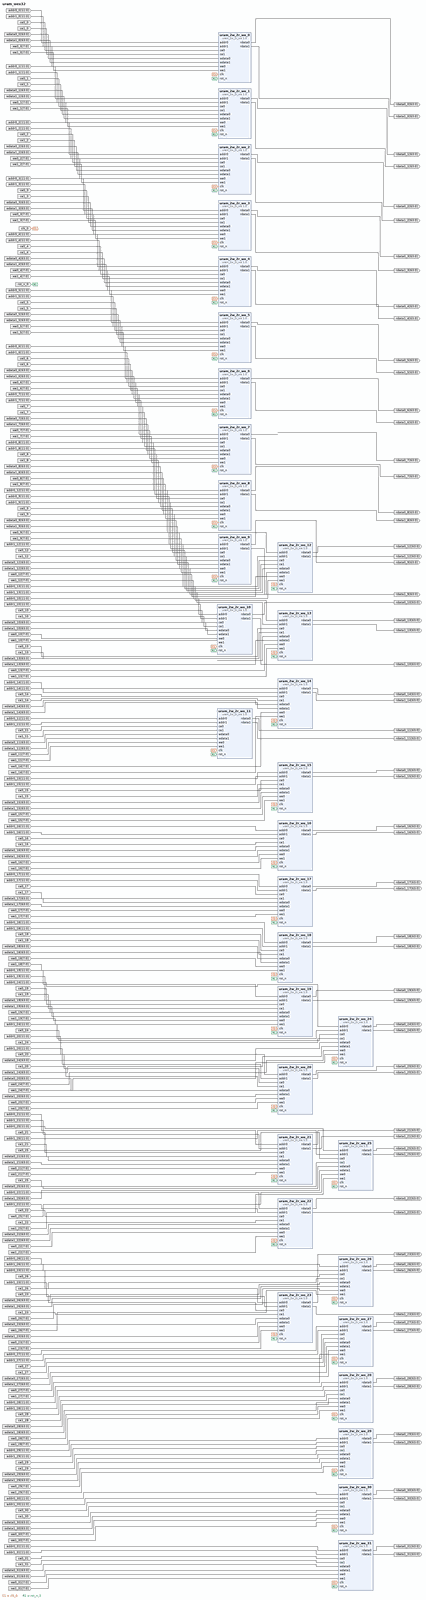
[diagram p0: block diagram of the top level, whole]
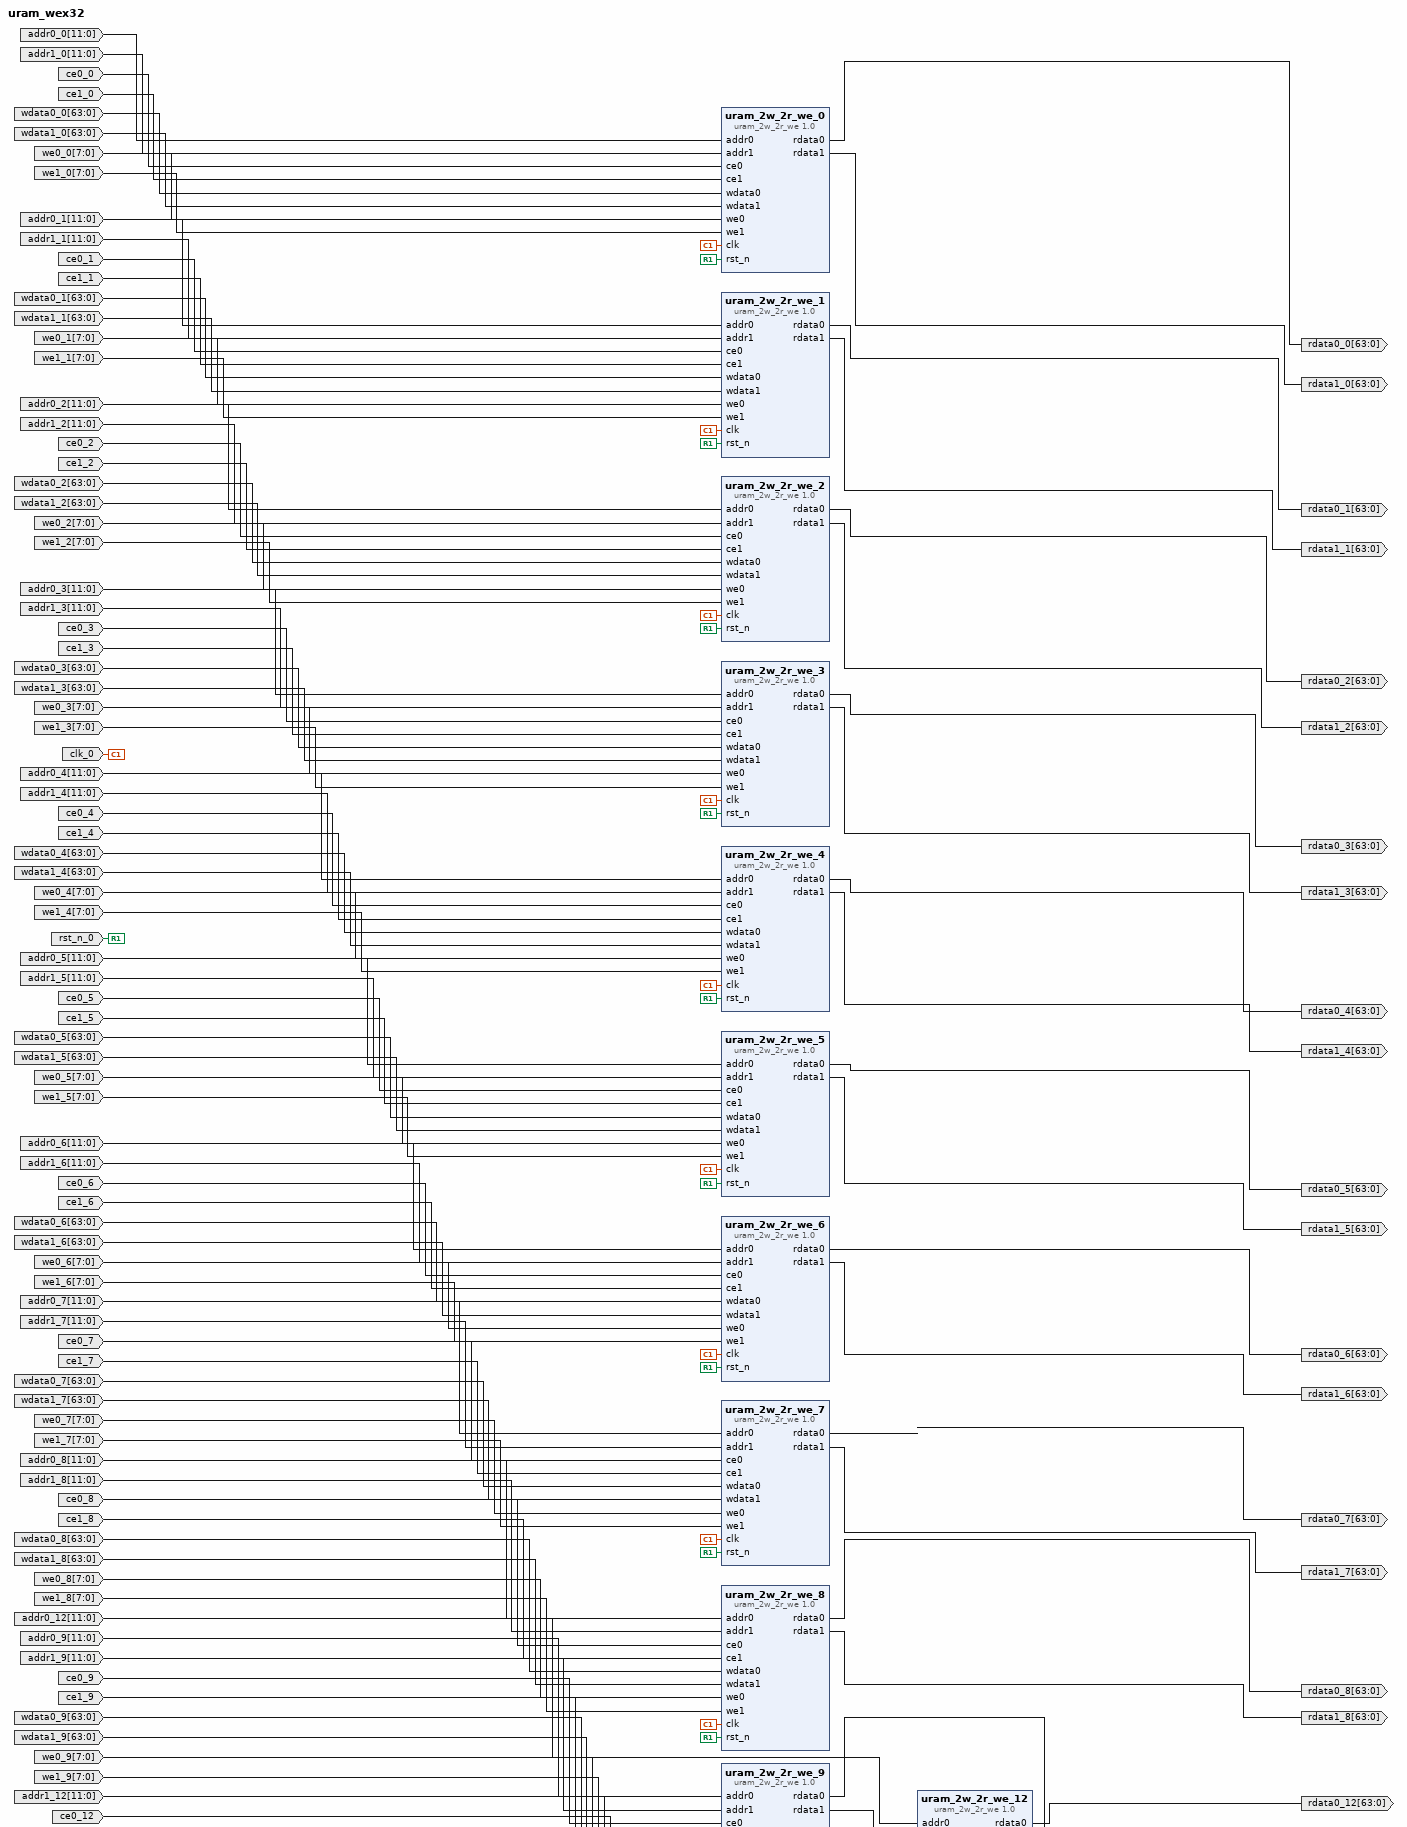
[diagram p1: block diagram of the top level, upper part]
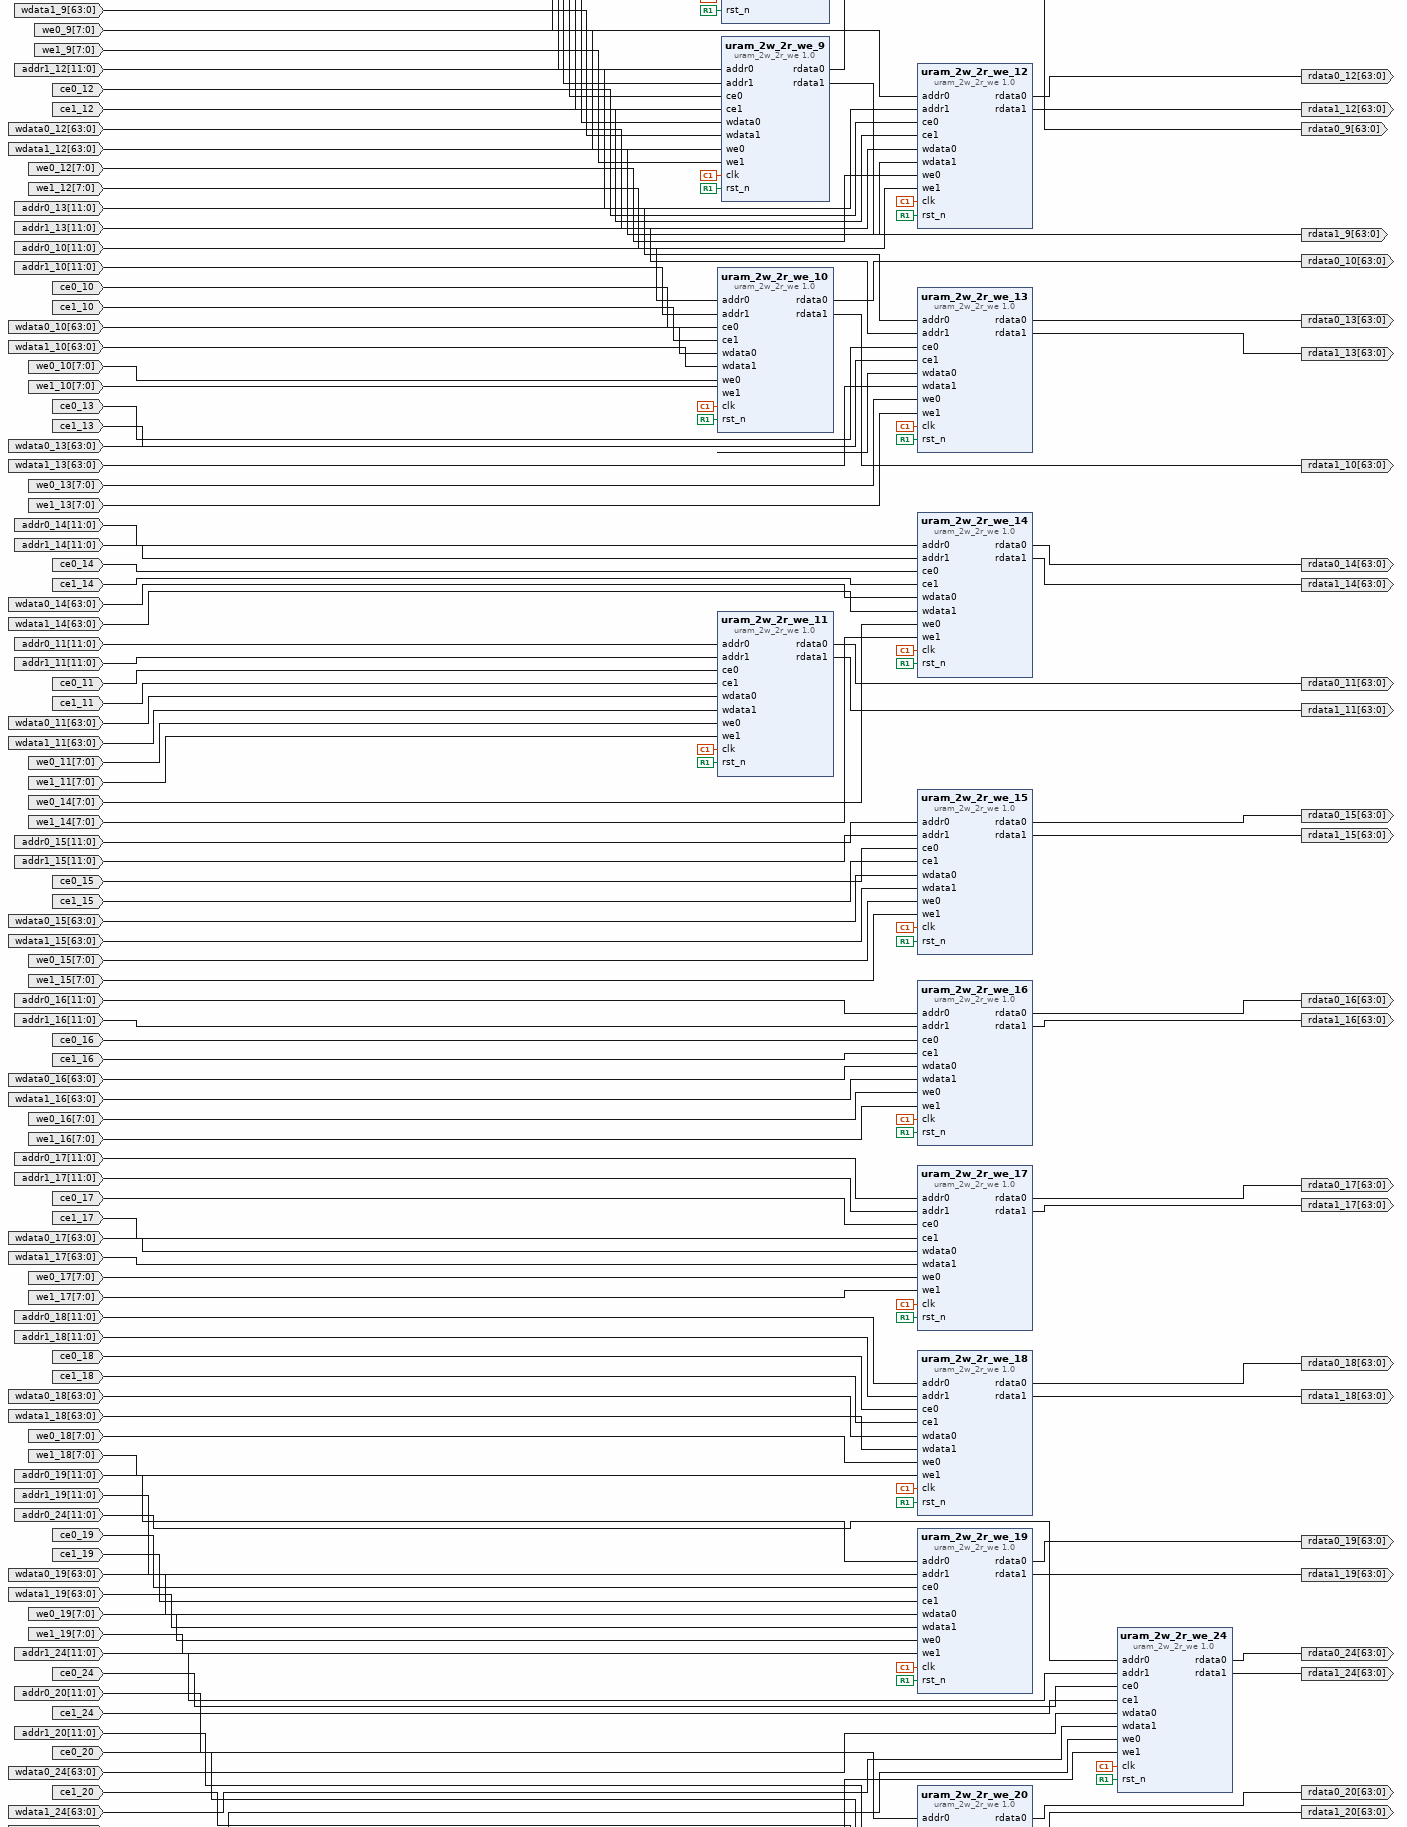
[diagram p2: block diagram of the top level, middle part]
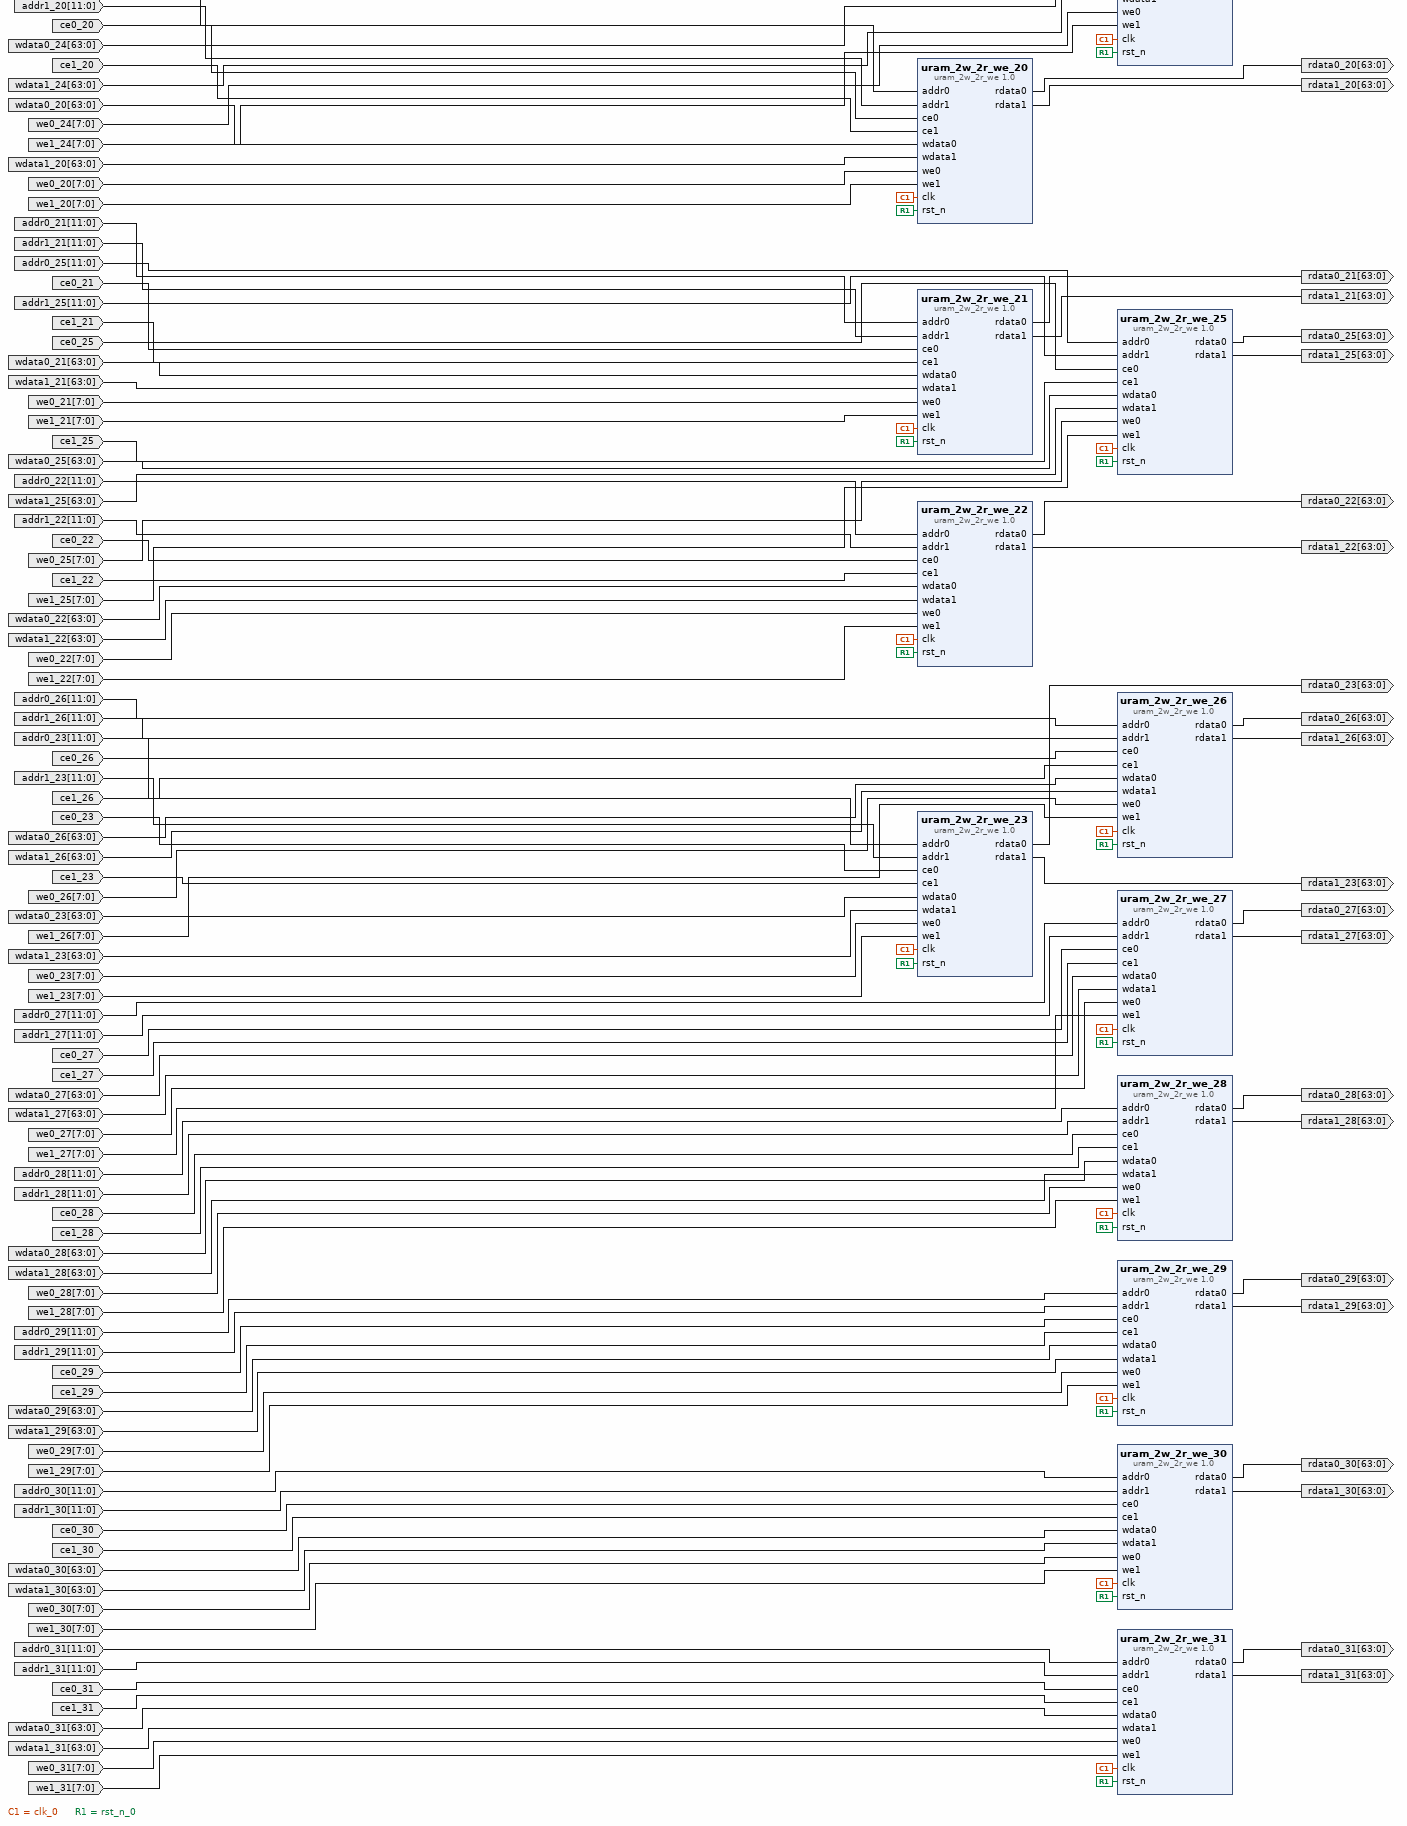
[diagram p3: block diagram of the top level, lower part]
# Vivado block design uram_wex32, xcu280-fsvh2892-2L-e, Vivado 2020.2
create_bd_design uram_wex32

create_bd_port -dir I -type clk clk_0
create_bd_port -dir I -type rst rst_n_0
create_bd_port -dir I -from 11 -to 0 addr0_0
create_bd_port -dir I -from 11 -to 0 addr1_0
create_bd_port -dir I ce0_0
create_bd_port -dir I ce1_0
create_bd_port -dir O -from 63 -to 0 rdata0_0
create_bd_port -dir O -from 63 -to 0 rdata1_0
create_bd_port -dir I -from 63 -to 0 wdata0_0
create_bd_port -dir I -from 63 -to 0 wdata1_0
create_bd_port -dir I -from 7 -to 0 we0_0
create_bd_port -dir I -from 7 -to 0 we1_0
create_bd_port -dir I -from 11 -to 0 addr0_1
create_bd_port -dir I -from 11 -to 0 addr1_1
create_bd_port -dir I ce0_1
create_bd_port -dir I ce1_1
create_bd_port -dir O -from 63 -to 0 rdata0_1
create_bd_port -dir O -from 63 -to 0 rdata1_1
create_bd_port -dir I -from 63 -to 0 wdata0_1
create_bd_port -dir I -from 63 -to 0 wdata1_1
create_bd_port -dir I -from 7 -to 0 we0_1
create_bd_port -dir I -from 7 -to 0 we1_1
create_bd_port -dir I -from 11 -to 0 addr0_2
create_bd_port -dir I -from 11 -to 0 addr1_2
create_bd_port -dir I ce0_2
create_bd_port -dir I ce1_2
create_bd_port -dir O -from 63 -to 0 rdata0_2
create_bd_port -dir O -from 63 -to 0 rdata1_2
create_bd_port -dir I -from 63 -to 0 wdata0_2
create_bd_port -dir I -from 63 -to 0 wdata1_2
create_bd_port -dir I -from 7 -to 0 we0_2
create_bd_port -dir I -from 7 -to 0 we1_2
create_bd_port -dir I -from 11 -to 0 addr0_3
create_bd_port -dir I -from 11 -to 0 addr1_3
create_bd_port -dir I ce0_3
create_bd_port -dir I ce1_3
create_bd_port -dir O -from 63 -to 0 rdata0_3
create_bd_port -dir O -from 63 -to 0 rdata1_3
create_bd_port -dir I -from 63 -to 0 wdata0_3
create_bd_port -dir I -from 63 -to 0 wdata1_3
create_bd_port -dir I -from 7 -to 0 we0_3
create_bd_port -dir I -from 7 -to 0 we1_3
create_bd_port -dir I -from 11 -to 0 addr0_4
create_bd_port -dir I -from 11 -to 0 addr1_4
create_bd_port -dir I ce0_4
create_bd_port -dir I ce1_4
create_bd_port -dir O -from 63 -to 0 rdata0_4
create_bd_port -dir O -from 63 -to 0 rdata1_4
create_bd_port -dir I -from 63 -to 0 wdata0_4
create_bd_port -dir I -from 63 -to 0 wdata1_4
create_bd_port -dir I -from 7 -to 0 we0_4
create_bd_port -dir I -from 7 -to 0 we1_4
create_bd_port -dir I -from 11 -to 0 addr0_5
create_bd_port -dir I -from 11 -to 0 addr1_5
create_bd_port -dir I ce0_5
create_bd_port -dir I ce1_5
create_bd_port -dir O -from 63 -to 0 rdata0_5
create_bd_port -dir O -from 63 -to 0 rdata1_5
create_bd_port -dir I -from 63 -to 0 wdata0_5
create_bd_port -dir I -from 63 -to 0 wdata1_5
create_bd_port -dir I -from 7 -to 0 we0_5
create_bd_port -dir I -from 7 -to 0 we1_5
create_bd_port -dir I -from 11 -to 0 addr0_6
create_bd_port -dir I -from 11 -to 0 addr1_6
create_bd_port -dir I ce0_6
create_bd_port -dir I ce1_6
create_bd_port -dir O -from 63 -to 0 rdata0_6
create_bd_port -dir O -from 63 -to 0 rdata1_6
create_bd_port -dir I -from 63 -to 0 wdata0_6
create_bd_port -dir I -from 63 -to 0 wdata1_6
create_bd_port -dir I -from 7 -to 0 we0_6
create_bd_port -dir I -from 7 -to 0 we1_6
create_bd_port -dir I -from 11 -to 0 addr0_7
create_bd_port -dir I -from 11 -to 0 addr1_7
create_bd_port -dir I ce0_7
create_bd_port -dir I ce1_7
create_bd_port -dir O -from 63 -to 0 rdata0_7
create_bd_port -dir O -from 63 -to 0 rdata1_7
create_bd_port -dir I -from 63 -to 0 wdata0_7
create_bd_port -dir I -from 63 -to 0 wdata1_7
create_bd_port -dir I -from 7 -to 0 we0_7
create_bd_port -dir I -from 7 -to 0 we1_7
create_bd_port -dir I -from 11 -to 0 addr0_8
create_bd_port -dir I -from 11 -to 0 addr1_8
create_bd_port -dir I ce0_8
create_bd_port -dir I ce1_8
create_bd_port -dir O -from 63 -to 0 rdata0_8
create_bd_port -dir O -from 63 -to 0 rdata1_8
create_bd_port -dir I -from 63 -to 0 wdata0_8
create_bd_port -dir I -from 63 -to 0 wdata1_8
create_bd_port -dir I -from 7 -to 0 we0_8
create_bd_port -dir I -from 7 -to 0 we1_8
create_bd_port -dir I -from 11 -to 0 addr0_9
create_bd_port -dir I -from 11 -to 0 addr1_9
create_bd_port -dir I ce0_9
create_bd_port -dir I ce1_9
create_bd_port -dir O -from 63 -to 0 rdata0_9
create_bd_port -dir O -from 63 -to 0 rdata1_9
create_bd_port -dir I -from 63 -to 0 wdata0_9
create_bd_port -dir I -from 63 -to 0 wdata1_9
create_bd_port -dir I -from 7 -to 0 we0_9
create_bd_port -dir I -from 7 -to 0 we1_9
create_bd_port -dir I -from 11 -to 0 addr0_10
create_bd_port -dir I -from 11 -to 0 addr1_10
create_bd_port -dir I ce0_10
create_bd_port -dir I ce1_10
create_bd_port -dir O -from 63 -to 0 rdata0_10
create_bd_port -dir O -from 63 -to 0 rdata1_10
create_bd_port -dir I -from 63 -to 0 wdata0_10
create_bd_port -dir I -from 63 -to 0 wdata1_10
create_bd_port -dir I -from 7 -to 0 we0_10
create_bd_port -dir I -from 7 -to 0 we1_10
create_bd_port -dir I -from 11 -to 0 addr0_11
create_bd_port -dir I -from 11 -to 0 addr1_11
create_bd_port -dir I ce0_11
create_bd_port -dir I ce1_11
create_bd_port -dir O -from 63 -to 0 rdata0_11
create_bd_port -dir O -from 63 -to 0 rdata1_11
create_bd_port -dir I -from 63 -to 0 wdata0_11
create_bd_port -dir I -from 63 -to 0 wdata1_11
create_bd_port -dir I -from 7 -to 0 we0_11
create_bd_port -dir I -from 7 -to 0 we1_11
create_bd_port -dir I -from 11 -to 0 addr0_12
create_bd_port -dir I -from 11 -to 0 addr1_12
create_bd_port -dir I ce0_12
create_bd_port -dir I ce1_12
create_bd_port -dir O -from 63 -to 0 rdata0_12
create_bd_port -dir O -from 63 -to 0 rdata1_12
create_bd_port -dir I -from 63 -to 0 wdata0_12
create_bd_port -dir I -from 63 -to 0 wdata1_12
create_bd_port -dir I -from 7 -to 0 we0_12
create_bd_port -dir I -from 7 -to 0 we1_12
create_bd_port -dir I -from 11 -to 0 addr0_13
create_bd_port -dir I -from 11 -to 0 addr1_13
create_bd_port -dir I ce0_13
create_bd_port -dir I ce1_13
create_bd_port -dir O -from 63 -to 0 rdata0_13
create_bd_port -dir O -from 63 -to 0 rdata1_13
create_bd_port -dir I -from 63 -to 0 wdata0_13
create_bd_port -dir I -from 63 -to 0 wdata1_13
create_bd_port -dir I -from 7 -to 0 we0_13
create_bd_port -dir I -from 7 -to 0 we1_13
create_bd_port -dir I -from 11 -to 0 addr0_14
create_bd_port -dir I -from 11 -to 0 addr1_14
create_bd_port -dir I ce0_14
create_bd_port -dir I ce1_14
create_bd_port -dir O -from 63 -to 0 rdata0_14
create_bd_port -dir O -from 63 -to 0 rdata1_14
create_bd_port -dir I -from 63 -to 0 wdata0_14
create_bd_port -dir I -from 63 -to 0 wdata1_14
create_bd_port -dir I -from 7 -to 0 we0_14
create_bd_port -dir I -from 7 -to 0 we1_14
create_bd_port -dir I -from 11 -to 0 addr0_15
create_bd_port -dir I -from 11 -to 0 addr1_15
create_bd_port -dir I ce0_15
create_bd_port -dir I ce1_15
create_bd_port -dir O -from 63 -to 0 rdata0_15
create_bd_port -dir O -from 63 -to 0 rdata1_15
create_bd_port -dir I -from 63 -to 0 wdata0_15
create_bd_port -dir I -from 63 -to 0 wdata1_15
create_bd_port -dir I -from 7 -to 0 we0_15
create_bd_port -dir I -from 7 -to 0 we1_15
create_bd_port -dir I -from 11 -to 0 addr0_16
create_bd_port -dir I -from 11 -to 0 addr1_16
create_bd_port -dir I ce0_16
create_bd_port -dir I ce1_16
create_bd_port -dir O -from 63 -to 0 rdata0_16
create_bd_port -dir O -from 63 -to 0 rdata1_16
create_bd_port -dir I -from 63 -to 0 wdata0_16
create_bd_port -dir I -from 63 -to 0 wdata1_16
create_bd_port -dir I -from 7 -to 0 we0_16
create_bd_port -dir I -from 7 -to 0 we1_16
create_bd_port -dir I -from 11 -to 0 addr0_17
create_bd_port -dir I -from 11 -to 0 addr1_17
create_bd_port -dir I ce0_17
create_bd_port -dir I ce1_17
create_bd_port -dir O -from 63 -to 0 rdata0_17
create_bd_port -dir O -from 63 -to 0 rdata1_17
create_bd_port -dir I -from 63 -to 0 wdata0_17
create_bd_port -dir I -from 63 -to 0 wdata1_17
create_bd_port -dir I -from 7 -to 0 we0_17
create_bd_port -dir I -from 7 -to 0 we1_17
create_bd_port -dir I -from 11 -to 0 addr0_18
create_bd_port -dir I -from 11 -to 0 addr1_18
create_bd_port -dir I ce0_18
create_bd_port -dir I ce1_18
create_bd_port -dir O -from 63 -to 0 rdata0_18
create_bd_port -dir O -from 63 -to 0 rdata1_18
create_bd_port -dir I -from 63 -to 0 wdata0_18
create_bd_port -dir I -from 63 -to 0 wdata1_18
create_bd_port -dir I -from 7 -to 0 we0_18
create_bd_port -dir I -from 7 -to 0 we1_18
create_bd_port -dir I -from 11 -to 0 addr0_19
create_bd_port -dir I -from 11 -to 0 addr1_19
create_bd_port -dir I ce0_19
create_bd_port -dir I ce1_19
create_bd_port -dir O -from 63 -to 0 rdata0_19
create_bd_port -dir O -from 63 -to 0 rdata1_19
create_bd_port -dir I -from 63 -to 0 wdata0_19
create_bd_port -dir I -from 63 -to 0 wdata1_19
create_bd_port -dir I -from 7 -to 0 we0_19
create_bd_port -dir I -from 7 -to 0 we1_19
create_bd_port -dir I -from 11 -to 0 addr0_20
create_bd_port -dir I -from 11 -to 0 addr1_20
create_bd_port -dir I ce0_20
create_bd_port -dir I ce1_20
create_bd_port -dir O -from 63 -to 0 rdata0_20
create_bd_port -dir O -from 63 -to 0 rdata1_20
create_bd_port -dir I -from 63 -to 0 wdata0_20
create_bd_port -dir I -from 63 -to 0 wdata1_20
create_bd_port -dir I -from 7 -to 0 we0_20
create_bd_port -dir I -from 7 -to 0 we1_20
create_bd_port -dir I -from 11 -to 0 addr0_21
create_bd_port -dir I -from 11 -to 0 addr1_21
create_bd_port -dir I ce0_21
create_bd_port -dir I ce1_21
create_bd_port -dir O -from 63 -to 0 rdata0_21
create_bd_port -dir O -from 63 -to 0 rdata1_21
create_bd_port -dir I -from 63 -to 0 wdata0_21
create_bd_port -dir I -from 63 -to 0 wdata1_21
create_bd_port -dir I -from 7 -to 0 we0_21
create_bd_port -dir I -from 7 -to 0 we1_21
create_bd_port -dir I -from 11 -to 0 addr0_22
create_bd_port -dir I -from 11 -to 0 addr1_22
create_bd_port -dir I ce0_22
create_bd_port -dir I ce1_22
create_bd_port -dir O -from 63 -to 0 rdata0_22
create_bd_port -dir O -from 63 -to 0 rdata1_22
create_bd_port -dir I -from 63 -to 0 wdata0_22
create_bd_port -dir I -from 63 -to 0 wdata1_22
create_bd_port -dir I -from 7 -to 0 we0_22
create_bd_port -dir I -from 7 -to 0 we1_22
create_bd_port -dir I -from 11 -to 0 addr0_23
create_bd_port -dir I -from 11 -to 0 addr1_23
create_bd_port -dir I ce0_23
create_bd_port -dir I ce1_23
create_bd_port -dir O -from 63 -to 0 rdata0_23
create_bd_port -dir O -from 63 -to 0 rdata1_23
create_bd_port -dir I -from 63 -to 0 wdata0_23
create_bd_port -dir I -from 63 -to 0 wdata1_23
create_bd_port -dir I -from 7 -to 0 we0_23
create_bd_port -dir I -from 7 -to 0 we1_23
create_bd_port -dir I -from 11 -to 0 addr0_24
create_bd_port -dir I -from 11 -to 0 addr1_24
create_bd_port -dir I ce0_24
create_bd_port -dir I ce1_24
create_bd_port -dir O -from 63 -to 0 rdata0_24
create_bd_port -dir O -from 63 -to 0 rdata1_24
create_bd_port -dir I -from 63 -to 0 wdata0_24
create_bd_port -dir I -from 63 -to 0 wdata1_24
create_bd_port -dir I -from 7 -to 0 we0_24
create_bd_port -dir I -from 7 -to 0 we1_24
create_bd_port -dir I -from 11 -to 0 addr0_25
create_bd_port -dir I -from 11 -to 0 addr1_25
create_bd_port -dir I ce0_25
create_bd_port -dir I ce1_25
create_bd_port -dir O -from 63 -to 0 rdata0_25
create_bd_port -dir O -from 63 -to 0 rdata1_25
create_bd_port -dir I -from 63 -to 0 wdata0_25
create_bd_port -dir I -from 63 -to 0 wdata1_25
create_bd_port -dir I -from 7 -to 0 we0_25
create_bd_port -dir I -from 7 -to 0 we1_25
create_bd_port -dir I -from 11 -to 0 addr0_26
create_bd_port -dir I -from 11 -to 0 addr1_26
create_bd_port -dir I ce0_26
create_bd_port -dir I ce1_26
create_bd_port -dir O -from 63 -to 0 rdata0_26
create_bd_port -dir O -from 63 -to 0 rdata1_26
create_bd_port -dir I -from 63 -to 0 wdata0_26
create_bd_port -dir I -from 63 -to 0 wdata1_26
create_bd_port -dir I -from 7 -to 0 we0_26
create_bd_port -dir I -from 7 -to 0 we1_26
create_bd_port -dir I -from 11 -to 0 addr0_27
create_bd_port -dir I -from 11 -to 0 addr1_27
create_bd_port -dir I ce0_27
create_bd_port -dir I ce1_27
create_bd_port -dir O -from 63 -to 0 rdata0_27
create_bd_port -dir O -from 63 -to 0 rdata1_27
create_bd_port -dir I -from 63 -to 0 wdata0_27
create_bd_port -dir I -from 63 -to 0 wdata1_27
create_bd_port -dir I -from 7 -to 0 we0_27
create_bd_port -dir I -from 7 -to 0 we1_27
create_bd_port -dir I -from 11 -to 0 addr0_28
create_bd_port -dir I -from 11 -to 0 addr1_28
create_bd_port -dir I ce0_28
create_bd_port -dir I ce1_28
create_bd_port -dir O -from 63 -to 0 rdata0_28
create_bd_port -dir O -from 63 -to 0 rdata1_28
create_bd_port -dir I -from 63 -to 0 wdata0_28
create_bd_port -dir I -from 63 -to 0 wdata1_28
create_bd_port -dir I -from 7 -to 0 we0_28
create_bd_port -dir I -from 7 -to 0 we1_28
create_bd_port -dir I -from 11 -to 0 addr0_29
create_bd_port -dir I -from 11 -to 0 addr1_29
create_bd_port -dir I ce0_29
create_bd_port -dir I ce1_29
create_bd_port -dir O -from 63 -to 0 rdata0_29
create_bd_port -dir O -from 63 -to 0 rdata1_29
create_bd_port -dir I -from 63 -to 0 wdata0_29
create_bd_port -dir I -from 63 -to 0 wdata1_29
create_bd_port -dir I -from 7 -to 0 we0_29
create_bd_port -dir I -from 7 -to 0 we1_29
create_bd_port -dir I -from 11 -to 0 addr0_30
create_bd_port -dir I -from 11 -to 0 addr1_30
create_bd_port -dir I ce0_30
create_bd_port -dir I ce1_30
create_bd_port -dir O -from 63 -to 0 rdata0_30
create_bd_port -dir O -from 63 -to 0 rdata1_30
create_bd_port -dir I -from 63 -to 0 wdata0_30
create_bd_port -dir I -from 63 -to 0 wdata1_30
create_bd_port -dir I -from 7 -to 0 we0_30
create_bd_port -dir I -from 7 -to 0 we1_30
create_bd_port -dir I -from 11 -to 0 addr0_31
create_bd_port -dir I -from 11 -to 0 addr1_31
create_bd_port -dir I ce0_31
create_bd_port -dir I ce1_31
create_bd_port -dir O -from 63 -to 0 rdata0_31
create_bd_port -dir O -from 63 -to 0 rdata1_31
create_bd_port -dir I -from 63 -to 0 wdata0_31
create_bd_port -dir I -from 63 -to 0 wdata1_31
create_bd_port -dir I -from 7 -to 0 we0_31
create_bd_port -dir I -from 7 -to 0 we1_31

create_bd_cell -type ip -vlnv user.org:user:uram_2w_2r_we:1.0 uram_2w_2r_we_0
create_bd_cell -type ip -vlnv user.org:user:uram_2w_2r_we:1.0 uram_2w_2r_we_1
create_bd_cell -type ip -vlnv user.org:user:uram_2w_2r_we:1.0 uram_2w_2r_we_2
create_bd_cell -type ip -vlnv user.org:user:uram_2w_2r_we:1.0 uram_2w_2r_we_3
create_bd_cell -type ip -vlnv user.org:user:uram_2w_2r_we:1.0 uram_2w_2r_we_4
create_bd_cell -type ip -vlnv user.org:user:uram_2w_2r_we:1.0 uram_2w_2r_we_5
create_bd_cell -type ip -vlnv user.org:user:uram_2w_2r_we:1.0 uram_2w_2r_we_6
create_bd_cell -type ip -vlnv user.org:user:uram_2w_2r_we:1.0 uram_2w_2r_we_7
create_bd_cell -type ip -vlnv user.org:user:uram_2w_2r_we:1.0 uram_2w_2r_we_8
create_bd_cell -type ip -vlnv user.org:user:uram_2w_2r_we:1.0 uram_2w_2r_we_9
create_bd_cell -type ip -vlnv user.org:user:uram_2w_2r_we:1.0 uram_2w_2r_we_10
create_bd_cell -type ip -vlnv user.org:user:uram_2w_2r_we:1.0 uram_2w_2r_we_11
create_bd_cell -type ip -vlnv user.org:user:uram_2w_2r_we:1.0 uram_2w_2r_we_12
create_bd_cell -type ip -vlnv user.org:user:uram_2w_2r_we:1.0 uram_2w_2r_we_13
create_bd_cell -type ip -vlnv user.org:user:uram_2w_2r_we:1.0 uram_2w_2r_we_14
create_bd_cell -type ip -vlnv user.org:user:uram_2w_2r_we:1.0 uram_2w_2r_we_15
create_bd_cell -type ip -vlnv user.org:user:uram_2w_2r_we:1.0 uram_2w_2r_we_16
create_bd_cell -type ip -vlnv user.org:user:uram_2w_2r_we:1.0 uram_2w_2r_we_17
create_bd_cell -type ip -vlnv user.org:user:uram_2w_2r_we:1.0 uram_2w_2r_we_18
create_bd_cell -type ip -vlnv user.org:user:uram_2w_2r_we:1.0 uram_2w_2r_we_19
create_bd_cell -type ip -vlnv user.org:user:uram_2w_2r_we:1.0 uram_2w_2r_we_20
create_bd_cell -type ip -vlnv user.org:user:uram_2w_2r_we:1.0 uram_2w_2r_we_21
create_bd_cell -type ip -vlnv user.org:user:uram_2w_2r_we:1.0 uram_2w_2r_we_22
create_bd_cell -type ip -vlnv user.org:user:uram_2w_2r_we:1.0 uram_2w_2r_we_23
create_bd_cell -type ip -vlnv user.org:user:uram_2w_2r_we:1.0 uram_2w_2r_we_24
create_bd_cell -type ip -vlnv user.org:user:uram_2w_2r_we:1.0 uram_2w_2r_we_25
create_bd_cell -type ip -vlnv user.org:user:uram_2w_2r_we:1.0 uram_2w_2r_we_26
create_bd_cell -type ip -vlnv user.org:user:uram_2w_2r_we:1.0 uram_2w_2r_we_27
create_bd_cell -type ip -vlnv user.org:user:uram_2w_2r_we:1.0 uram_2w_2r_we_28
create_bd_cell -type ip -vlnv user.org:user:uram_2w_2r_we:1.0 uram_2w_2r_we_29
create_bd_cell -type ip -vlnv user.org:user:uram_2w_2r_we:1.0 uram_2w_2r_we_30
create_bd_cell -type ip -vlnv user.org:user:uram_2w_2r_we:1.0 uram_2w_2r_we_31

# ---- connections ----

connect_bd_net -net clk_0_1 [get_bd_ports clk_0] \
  [get_bd_pins uram_2w_2r_we_0/clk] [get_bd_pins uram_2w_2r_we_1/clk] [get_bd_pins uram_2w_2r_we_2/clk] \
  [get_bd_pins uram_2w_2r_we_3/clk] [get_bd_pins uram_2w_2r_we_4/clk] [get_bd_pins uram_2w_2r_we_5/clk] \
  [get_bd_pins uram_2w_2r_we_6/clk] [get_bd_pins uram_2w_2r_we_7/clk] [get_bd_pins uram_2w_2r_we_8/clk] \
  [get_bd_pins uram_2w_2r_we_9/clk] [get_bd_pins uram_2w_2r_we_10/clk] [get_bd_pins uram_2w_2r_we_11/clk] \
  [get_bd_pins uram_2w_2r_we_12/clk] [get_bd_pins uram_2w_2r_we_13/clk] [get_bd_pins uram_2w_2r_we_14/clk] \
  [get_bd_pins uram_2w_2r_we_15/clk] [get_bd_pins uram_2w_2r_we_16/clk] [get_bd_pins uram_2w_2r_we_17/clk] \
  [get_bd_pins uram_2w_2r_we_18/clk] [get_bd_pins uram_2w_2r_we_19/clk] [get_bd_pins uram_2w_2r_we_20/clk] \
  [get_bd_pins uram_2w_2r_we_21/clk] [get_bd_pins uram_2w_2r_we_22/clk] [get_bd_pins uram_2w_2r_we_23/clk] \
  [get_bd_pins uram_2w_2r_we_24/clk] [get_bd_pins uram_2w_2r_we_25/clk] [get_bd_pins uram_2w_2r_we_26/clk] \
  [get_bd_pins uram_2w_2r_we_27/clk] [get_bd_pins uram_2w_2r_we_28/clk] [get_bd_pins uram_2w_2r_we_29/clk] \
  [get_bd_pins uram_2w_2r_we_30/clk] [get_bd_pins uram_2w_2r_we_31/clk]
connect_bd_net -net rst_n_0_1 [get_bd_ports rst_n_0] \
  [get_bd_pins uram_2w_2r_we_0/rst_n] [get_bd_pins uram_2w_2r_we_1/rst_n] [get_bd_pins uram_2w_2r_we_2/rst_n] \
  [get_bd_pins uram_2w_2r_we_3/rst_n] [get_bd_pins uram_2w_2r_we_4/rst_n] [get_bd_pins uram_2w_2r_we_5/rst_n] \
  [get_bd_pins uram_2w_2r_we_6/rst_n] [get_bd_pins uram_2w_2r_we_7/rst_n] [get_bd_pins uram_2w_2r_we_8/rst_n] \
  [get_bd_pins uram_2w_2r_we_9/rst_n] [get_bd_pins uram_2w_2r_we_10/rst_n] [get_bd_pins uram_2w_2r_we_11/rst_n] \
  [get_bd_pins uram_2w_2r_we_12/rst_n] [get_bd_pins uram_2w_2r_we_13/rst_n] [get_bd_pins uram_2w_2r_we_14/rst_n] \
  [get_bd_pins uram_2w_2r_we_15/rst_n] [get_bd_pins uram_2w_2r_we_16/rst_n] [get_bd_pins uram_2w_2r_we_17/rst_n] \
  [get_bd_pins uram_2w_2r_we_18/rst_n] [get_bd_pins uram_2w_2r_we_19/rst_n] [get_bd_pins uram_2w_2r_we_20/rst_n] \
  [get_bd_pins uram_2w_2r_we_21/rst_n] [get_bd_pins uram_2w_2r_we_22/rst_n] [get_bd_pins uram_2w_2r_we_23/rst_n] \
  [get_bd_pins uram_2w_2r_we_24/rst_n] [get_bd_pins uram_2w_2r_we_25/rst_n] [get_bd_pins uram_2w_2r_we_26/rst_n] \
  [get_bd_pins uram_2w_2r_we_27/rst_n] [get_bd_pins uram_2w_2r_we_28/rst_n] [get_bd_pins uram_2w_2r_we_29/rst_n] \
  [get_bd_pins uram_2w_2r_we_30/rst_n] [get_bd_pins uram_2w_2r_we_31/rst_n]
connect_bd_net -net addr0_0_1 [get_bd_ports addr0_0] [get_bd_pins uram_2w_2r_we_0/addr0]
connect_bd_net -net addr1_0_1 [get_bd_ports addr1_0] [get_bd_pins uram_2w_2r_we_0/addr1]
connect_bd_net -net ce0_0_1 [get_bd_ports ce0_0] [get_bd_pins uram_2w_2r_we_0/ce0]
connect_bd_net -net ce1_0_1 [get_bd_ports ce1_0] [get_bd_pins uram_2w_2r_we_0/ce1]
connect_bd_net [get_bd_pins uram_2w_2r_we_0/rdata0] [get_bd_ports rdata0_0]
connect_bd_net [get_bd_pins uram_2w_2r_we_0/rdata1] [get_bd_ports rdata1_0]
connect_bd_net -net wdata0_0_1 [get_bd_ports wdata0_0] [get_bd_pins uram_2w_2r_we_0/wdata0]
connect_bd_net -net wdata1_0_1 [get_bd_ports wdata1_0] [get_bd_pins uram_2w_2r_we_0/wdata1]
connect_bd_net -net we0_0_1 [get_bd_ports we0_0] [get_bd_pins uram_2w_2r_we_0/we0]
connect_bd_net -net we1_0_1 [get_bd_ports we1_0] [get_bd_pins uram_2w_2r_we_0/we1]
connect_bd_net -net addr0_1_1 [get_bd_ports addr0_1] [get_bd_pins uram_2w_2r_we_1/addr0]
connect_bd_net -net addr1_1_1 [get_bd_ports addr1_1] [get_bd_pins uram_2w_2r_we_1/addr1]
connect_bd_net -net ce0_1_1 [get_bd_ports ce0_1] [get_bd_pins uram_2w_2r_we_1/ce0]
connect_bd_net -net ce1_1_1 [get_bd_ports ce1_1] [get_bd_pins uram_2w_2r_we_1/ce1]
connect_bd_net [get_bd_pins uram_2w_2r_we_1/rdata0] [get_bd_ports rdata0_1]
connect_bd_net [get_bd_pins uram_2w_2r_we_1/rdata1] [get_bd_ports rdata1_1]
connect_bd_net -net wdata0_1_1 [get_bd_ports wdata0_1] [get_bd_pins uram_2w_2r_we_1/wdata0]
connect_bd_net -net wdata1_1_1 [get_bd_ports wdata1_1] [get_bd_pins uram_2w_2r_we_1/wdata1]
connect_bd_net -net we0_1_1 [get_bd_ports we0_1] [get_bd_pins uram_2w_2r_we_1/we0]
connect_bd_net -net we1_1_1 [get_bd_ports we1_1] [get_bd_pins uram_2w_2r_we_1/we1]
connect_bd_net -net addr0_2_1 [get_bd_ports addr0_2] [get_bd_pins uram_2w_2r_we_2/addr0]
connect_bd_net -net addr1_2_1 [get_bd_ports addr1_2] [get_bd_pins uram_2w_2r_we_2/addr1]
connect_bd_net -net ce0_2_1 [get_bd_ports ce0_2] [get_bd_pins uram_2w_2r_we_2/ce0]
connect_bd_net -net ce1_2_1 [get_bd_ports ce1_2] [get_bd_pins uram_2w_2r_we_2/ce1]
connect_bd_net [get_bd_pins uram_2w_2r_we_2/rdata0] [get_bd_ports rdata0_2]
connect_bd_net [get_bd_pins uram_2w_2r_we_2/rdata1] [get_bd_ports rdata1_2]
connect_bd_net -net wdata0_2_1 [get_bd_ports wdata0_2] [get_bd_pins uram_2w_2r_we_2/wdata0]
connect_bd_net -net wdata1_2_1 [get_bd_ports wdata1_2] [get_bd_pins uram_2w_2r_we_2/wdata1]
connect_bd_net -net we0_2_1 [get_bd_ports we0_2] [get_bd_pins uram_2w_2r_we_2/we0]
connect_bd_net -net we1_2_1 [get_bd_ports we1_2] [get_bd_pins uram_2w_2r_we_2/we1]
connect_bd_net -net addr0_3_1 [get_bd_ports addr0_3] [get_bd_pins uram_2w_2r_we_3/addr0]
connect_bd_net -net addr1_3_1 [get_bd_ports addr1_3] [get_bd_pins uram_2w_2r_we_3/addr1]
connect_bd_net -net ce0_3_1 [get_bd_ports ce0_3] [get_bd_pins uram_2w_2r_we_3/ce0]
connect_bd_net -net ce1_3_1 [get_bd_ports ce1_3] [get_bd_pins uram_2w_2r_we_3/ce1]
connect_bd_net [get_bd_pins uram_2w_2r_we_3/rdata0] [get_bd_ports rdata0_3]
connect_bd_net [get_bd_pins uram_2w_2r_we_3/rdata1] [get_bd_ports rdata1_3]
connect_bd_net -net wdata0_3_1 [get_bd_ports wdata0_3] [get_bd_pins uram_2w_2r_we_3/wdata0]
connect_bd_net -net wdata1_3_1 [get_bd_ports wdata1_3] [get_bd_pins uram_2w_2r_we_3/wdata1]
connect_bd_net -net we0_3_1 [get_bd_ports we0_3] [get_bd_pins uram_2w_2r_we_3/we0]
connect_bd_net -net we1_3_1 [get_bd_ports we1_3] [get_bd_pins uram_2w_2r_we_3/we1]
connect_bd_net -net addr0_4_1 [get_bd_ports addr0_4] [get_bd_pins uram_2w_2r_we_4/addr0]
connect_bd_net -net addr1_4_1 [get_bd_ports addr1_4] [get_bd_pins uram_2w_2r_we_4/addr1]
connect_bd_net -net ce0_4_1 [get_bd_ports ce0_4] [get_bd_pins uram_2w_2r_we_4/ce0]
connect_bd_net -net ce1_4_1 [get_bd_ports ce1_4] [get_bd_pins uram_2w_2r_we_4/ce1]
connect_bd_net [get_bd_pins uram_2w_2r_we_4/rdata0] [get_bd_ports rdata0_4]
connect_bd_net [get_bd_pins uram_2w_2r_we_4/rdata1] [get_bd_ports rdata1_4]
connect_bd_net -net wdata0_4_1 [get_bd_ports wdata0_4] [get_bd_pins uram_2w_2r_we_4/wdata0]
connect_bd_net -net wdata1_4_1 [get_bd_ports wdata1_4] [get_bd_pins uram_2w_2r_we_4/wdata1]
connect_bd_net -net we0_4_1 [get_bd_ports we0_4] [get_bd_pins uram_2w_2r_we_4/we0]
connect_bd_net -net we1_4_1 [get_bd_ports we1_4] [get_bd_pins uram_2w_2r_we_4/we1]
connect_bd_net -net addr0_5_1 [get_bd_ports addr0_5] [get_bd_pins uram_2w_2r_we_5/addr0]
connect_bd_net -net addr1_5_1 [get_bd_ports addr1_5] [get_bd_pins uram_2w_2r_we_5/addr1]
connect_bd_net -net ce0_5_1 [get_bd_ports ce0_5] [get_bd_pins uram_2w_2r_we_5/ce0]
connect_bd_net -net ce1_5_1 [get_bd_ports ce1_5] [get_bd_pins uram_2w_2r_we_5/ce1]
connect_bd_net [get_bd_pins uram_2w_2r_we_5/rdata0] [get_bd_ports rdata0_5]
connect_bd_net [get_bd_pins uram_2w_2r_we_5/rdata1] [get_bd_ports rdata1_5]
connect_bd_net -net wdata0_5_1 [get_bd_ports wdata0_5] [get_bd_pins uram_2w_2r_we_5/wdata0]
connect_bd_net -net wdata1_5_1 [get_bd_ports wdata1_5] [get_bd_pins uram_2w_2r_we_5/wdata1]
connect_bd_net -net we0_5_1 [get_bd_ports we0_5] [get_bd_pins uram_2w_2r_we_5/we0]
connect_bd_net -net we1_5_1 [get_bd_ports we1_5] [get_bd_pins uram_2w_2r_we_5/we1]
connect_bd_net -net addr0_6_1 [get_bd_ports addr0_6] [get_bd_pins uram_2w_2r_we_6/addr0]
connect_bd_net -net addr1_6_1 [get_bd_ports addr1_6] [get_bd_pins uram_2w_2r_we_6/addr1]
connect_bd_net -net ce0_6_1 [get_bd_ports ce0_6] [get_bd_pins uram_2w_2r_we_6/ce0]
connect_bd_net -net ce1_6_1 [get_bd_ports ce1_6] [get_bd_pins uram_2w_2r_we_6/ce1]
connect_bd_net [get_bd_pins uram_2w_2r_we_6/rdata0] [get_bd_ports rdata0_6]
connect_bd_net [get_bd_pins uram_2w_2r_we_6/rdata1] [get_bd_ports rdata1_6]
connect_bd_net -net wdata0_6_1 [get_bd_ports wdata0_6] [get_bd_pins uram_2w_2r_we_6/wdata0]
connect_bd_net -net wdata1_6_1 [get_bd_ports wdata1_6] [get_bd_pins uram_2w_2r_we_6/wdata1]
connect_bd_net -net we0_6_1 [get_bd_ports we0_6] [get_bd_pins uram_2w_2r_we_6/we0]
connect_bd_net -net we1_6_1 [get_bd_ports we1_6] [get_bd_pins uram_2w_2r_we_6/we1]
connect_bd_net -net addr0_7_1 [get_bd_ports addr0_7] [get_bd_pins uram_2w_2r_we_7/addr0]
connect_bd_net -net addr1_7_1 [get_bd_ports addr1_7] [get_bd_pins uram_2w_2r_we_7/addr1]
connect_bd_net -net ce0_7_1 [get_bd_ports ce0_7] [get_bd_pins uram_2w_2r_we_7/ce0]
connect_bd_net -net ce1_7_1 [get_bd_ports ce1_7] [get_bd_pins uram_2w_2r_we_7/ce1]
connect_bd_net [get_bd_pins uram_2w_2r_we_7/rdata0] [get_bd_ports rdata0_7]
connect_bd_net [get_bd_pins uram_2w_2r_we_7/rdata1] [get_bd_ports rdata1_7]
connect_bd_net -net wdata0_7_1 [get_bd_ports wdata0_7] [get_bd_pins uram_2w_2r_we_7/wdata0]
connect_bd_net -net wdata1_7_1 [get_bd_ports wdata1_7] [get_bd_pins uram_2w_2r_we_7/wdata1]
connect_bd_net -net we0_7_1 [get_bd_ports we0_7] [get_bd_pins uram_2w_2r_we_7/we0]
connect_bd_net -net we1_7_1 [get_bd_ports we1_7] [get_bd_pins uram_2w_2r_we_7/we1]
connect_bd_net -net addr0_8_1 [get_bd_ports addr0_8] [get_bd_pins uram_2w_2r_we_8/addr0]
connect_bd_net -net addr1_8_1 [get_bd_ports addr1_8] [get_bd_pins uram_2w_2r_we_8/addr1]
connect_bd_net -net ce0_8_1 [get_bd_ports ce0_8] [get_bd_pins uram_2w_2r_we_8/ce0]
connect_bd_net -net ce1_8_1 [get_bd_ports ce1_8] [get_bd_pins uram_2w_2r_we_8/ce1]
connect_bd_net [get_bd_pins uram_2w_2r_we_8/rdata0] [get_bd_ports rdata0_8]
connect_bd_net [get_bd_pins uram_2w_2r_we_8/rdata1] [get_bd_ports rdata1_8]
connect_bd_net -net wdata0_8_1 [get_bd_ports wdata0_8] [get_bd_pins uram_2w_2r_we_8/wdata0]
connect_bd_net -net wdata1_8_1 [get_bd_ports wdata1_8] [get_bd_pins uram_2w_2r_we_8/wdata1]
connect_bd_net -net we0_8_1 [get_bd_ports we0_8] [get_bd_pins uram_2w_2r_we_8/we0]
connect_bd_net -net we1_8_1 [get_bd_ports we1_8] [get_bd_pins uram_2w_2r_we_8/we1]
connect_bd_net -net addr0_9_1 [get_bd_ports addr0_9] [get_bd_pins uram_2w_2r_we_9/addr0]
connect_bd_net -net addr1_9_1 [get_bd_ports addr1_9] [get_bd_pins uram_2w_2r_we_9/addr1]
connect_bd_net -net ce0_9_1 [get_bd_ports ce0_9] [get_bd_pins uram_2w_2r_we_9/ce0]
connect_bd_net -net ce1_9_1 [get_bd_ports ce1_9] [get_bd_pins uram_2w_2r_we_9/ce1]
connect_bd_net [get_bd_pins uram_2w_2r_we_9/rdata0] [get_bd_ports rdata0_9]
connect_bd_net [get_bd_pins uram_2w_2r_we_9/rdata1] [get_bd_ports rdata1_9]
connect_bd_net -net wdata0_9_1 [get_bd_ports wdata0_9] [get_bd_pins uram_2w_2r_we_9/wdata0]
connect_bd_net -net wdata1_9_1 [get_bd_ports wdata1_9] [get_bd_pins uram_2w_2r_we_9/wdata1]
connect_bd_net -net we0_9_1 [get_bd_ports we0_9] [get_bd_pins uram_2w_2r_we_9/we0]
connect_bd_net -net we1_9_1 [get_bd_ports we1_9] [get_bd_pins uram_2w_2r_we_9/we1]
connect_bd_net -net addr0_10_1 [get_bd_ports addr0_10] [get_bd_pins uram_2w_2r_we_10/addr0]
connect_bd_net -net addr1_10_1 [get_bd_ports addr1_10] [get_bd_pins uram_2w_2r_we_10/addr1]
connect_bd_net -net ce0_10_1 [get_bd_ports ce0_10] [get_bd_pins uram_2w_2r_we_10/ce0]
connect_bd_net -net ce1_10_1 [get_bd_ports ce1_10] [get_bd_pins uram_2w_2r_we_10/ce1]
connect_bd_net [get_bd_pins uram_2w_2r_we_10/rdata0] [get_bd_ports rdata0_10]
connect_bd_net [get_bd_pins uram_2w_2r_we_10/rdata1] [get_bd_ports rdata1_10]
connect_bd_net -net wdata0_10_1 [get_bd_ports wdata0_10] [get_bd_pins uram_2w_2r_we_10/wdata0]
connect_bd_net -net wdata1_10_1 [get_bd_ports wdata1_10] [get_bd_pins uram_2w_2r_we_10/wdata1]
connect_bd_net -net we0_10_1 [get_bd_ports we0_10] [get_bd_pins uram_2w_2r_we_10/we0]
connect_bd_net -net we1_10_1 [get_bd_ports we1_10] [get_bd_pins uram_2w_2r_we_10/we1]
connect_bd_net -net addr0_11_1 [get_bd_ports addr0_11] [get_bd_pins uram_2w_2r_we_11/addr0]
connect_bd_net -net addr1_11_1 [get_bd_ports addr1_11] [get_bd_pins uram_2w_2r_we_11/addr1]
connect_bd_net -net ce0_11_1 [get_bd_ports ce0_11] [get_bd_pins uram_2w_2r_we_11/ce0]
connect_bd_net -net ce1_11_1 [get_bd_ports ce1_11] [get_bd_pins uram_2w_2r_we_11/ce1]
connect_bd_net [get_bd_pins uram_2w_2r_we_11/rdata0] [get_bd_ports rdata0_11]
connect_bd_net [get_bd_pins uram_2w_2r_we_11/rdata1] [get_bd_ports rdata1_11]
connect_bd_net -net wdata0_11_1 [get_bd_ports wdata0_11] [get_bd_pins uram_2w_2r_we_11/wdata0]
connect_bd_net -net wdata1_11_1 [get_bd_ports wdata1_11] [get_bd_pins uram_2w_2r_we_11/wdata1]
connect_bd_net -net we0_11_1 [get_bd_ports we0_11] [get_bd_pins uram_2w_2r_we_11/we0]
connect_bd_net -net we1_11_1 [get_bd_ports we1_11] [get_bd_pins uram_2w_2r_we_11/we1]
connect_bd_net -net addr0_12_1 [get_bd_ports addr0_12] [get_bd_pins uram_2w_2r_we_12/addr0]
connect_bd_net -net addr1_12_1 [get_bd_ports addr1_12] [get_bd_pins uram_2w_2r_we_12/addr1]
connect_bd_net -net ce0_12_1 [get_bd_ports ce0_12] [get_bd_pins uram_2w_2r_we_12/ce0]
connect_bd_net -net ce1_12_1 [get_bd_ports ce1_12] [get_bd_pins uram_2w_2r_we_12/ce1]
connect_bd_net [get_bd_pins uram_2w_2r_we_12/rdata0] [get_bd_ports rdata0_12]
connect_bd_net [get_bd_pins uram_2w_2r_we_12/rdata1] [get_bd_ports rdata1_12]
connect_bd_net -net wdata0_12_1 [get_bd_ports wdata0_12] [get_bd_pins uram_2w_2r_we_12/wdata0]
connect_bd_net -net wdata1_12_1 [get_bd_ports wdata1_12] [get_bd_pins uram_2w_2r_we_12/wdata1]
connect_bd_net -net we0_12_1 [get_bd_ports we0_12] [get_bd_pins uram_2w_2r_we_12/we0]
connect_bd_net -net we1_12_1 [get_bd_ports we1_12] [get_bd_pins uram_2w_2r_we_12/we1]
connect_bd_net -net addr0_13_1 [get_bd_ports addr0_13] [get_bd_pins uram_2w_2r_we_13/addr0]
connect_bd_net -net addr1_13_1 [get_bd_ports addr1_13] [get_bd_pins uram_2w_2r_we_13/addr1]
connect_bd_net -net ce0_13_1 [get_bd_ports ce0_13] [get_bd_pins uram_2w_2r_we_13/ce0]
connect_bd_net -net ce1_13_1 [get_bd_ports ce1_13] [get_bd_pins uram_2w_2r_we_13/ce1]
connect_bd_net [get_bd_pins uram_2w_2r_we_13/rdata0] [get_bd_ports rdata0_13]
connect_bd_net [get_bd_pins uram_2w_2r_we_13/rdata1] [get_bd_ports rdata1_13]
connect_bd_net -net wdata0_13_1 [get_bd_ports wdata0_13] [get_bd_pins uram_2w_2r_we_13/wdata0]
connect_bd_net -net wdata1_13_1 [get_bd_ports wdata1_13] [get_bd_pins uram_2w_2r_we_13/wdata1]
connect_bd_net -net we0_13_1 [get_bd_ports we0_13] [get_bd_pins uram_2w_2r_we_13/we0]
connect_bd_net -net we1_13_1 [get_bd_ports we1_13] [get_bd_pins uram_2w_2r_we_13/we1]
connect_bd_net -net addr0_14_1 [get_bd_ports addr0_14] [get_bd_pins uram_2w_2r_we_14/addr0]
connect_bd_net -net addr1_14_1 [get_bd_ports addr1_14] [get_bd_pins uram_2w_2r_we_14/addr1]
connect_bd_net -net ce0_14_1 [get_bd_ports ce0_14] [get_bd_pins uram_2w_2r_we_14/ce0]
connect_bd_net -net ce1_14_1 [get_bd_ports ce1_14] [get_bd_pins uram_2w_2r_we_14/ce1]
connect_bd_net [get_bd_pins uram_2w_2r_we_14/rdata0] [get_bd_ports rdata0_14]
connect_bd_net [get_bd_pins uram_2w_2r_we_14/rdata1] [get_bd_ports rdata1_14]
connect_bd_net -net wdata0_14_1 [get_bd_ports wdata0_14] [get_bd_pins uram_2w_2r_we_14/wdata0]
connect_bd_net -net wdata1_14_1 [get_bd_ports wdata1_14] [get_bd_pins uram_2w_2r_we_14/wdata1]
connect_bd_net -net we0_14_1 [get_bd_ports we0_14] [get_bd_pins uram_2w_2r_we_14/we0]
connect_bd_net -net we1_14_1 [get_bd_ports we1_14] [get_bd_pins uram_2w_2r_we_14/we1]
connect_bd_net -net addr0_15_1 [get_bd_ports addr0_15] [get_bd_pins uram_2w_2r_we_15/addr0]
connect_bd_net -net addr1_15_1 [get_bd_ports addr1_15] [get_bd_pins uram_2w_2r_we_15/addr1]
connect_bd_net -net ce0_15_1 [get_bd_ports ce0_15] [get_bd_pins uram_2w_2r_we_15/ce0]
connect_bd_net -net ce1_15_1 [get_bd_ports ce1_15] [get_bd_pins uram_2w_2r_we_15/ce1]
connect_bd_net [get_bd_pins uram_2w_2r_we_15/rdata0] [get_bd_ports rdata0_15]
connect_bd_net [get_bd_pins uram_2w_2r_we_15/rdata1] [get_bd_ports rdata1_15]
connect_bd_net -net wdata0_15_1 [get_bd_ports wdata0_15] [get_bd_pins uram_2w_2r_we_15/wdata0]
connect_bd_net -net wdata1_15_1 [get_bd_ports wdata1_15] [get_bd_pins uram_2w_2r_we_15/wdata1]
connect_bd_net -net we0_15_1 [get_bd_ports we0_15] [get_bd_pins uram_2w_2r_we_15/we0]
connect_bd_net -net we1_15_1 [get_bd_ports we1_15] [get_bd_pins uram_2w_2r_we_15/we1]
connect_bd_net -net addr0_16_1 [get_bd_ports addr0_16] [get_bd_pins uram_2w_2r_we_16/addr0]
connect_bd_net -net addr1_16_1 [get_bd_ports addr1_16] [get_bd_pins uram_2w_2r_we_16/addr1]
connect_bd_net -net ce0_16_1 [get_bd_ports ce0_16] [get_bd_pins uram_2w_2r_we_16/ce0]
connect_bd_net -net ce1_16_1 [get_bd_ports ce1_16] [get_bd_pins uram_2w_2r_we_16/ce1]
connect_bd_net [get_bd_pins uram_2w_2r_we_16/rdata0] [get_bd_ports rdata0_16]
connect_bd_net [get_bd_pins uram_2w_2r_we_16/rdata1] [get_bd_ports rdata1_16]
connect_bd_net -net wdata0_16_1 [get_bd_ports wdata0_16] [get_bd_pins uram_2w_2r_we_16/wdata0]
connect_bd_net -net wdata1_16_1 [get_bd_ports wdata1_16] [get_bd_pins uram_2w_2r_we_16/wdata1]
connect_bd_net -net we0_16_1 [get_bd_ports we0_16] [get_bd_pins uram_2w_2r_we_16/we0]
connect_bd_net -net we1_16_1 [get_bd_ports we1_16] [get_bd_pins uram_2w_2r_we_16/we1]
connect_bd_net -net addr0_17_1 [get_bd_ports addr0_17] [get_bd_pins uram_2w_2r_we_17/addr0]
connect_bd_net -net addr1_17_1 [get_bd_ports addr1_17] [get_bd_pins uram_2w_2r_we_17/addr1]
connect_bd_net -net ce0_17_1 [get_bd_ports ce0_17] [get_bd_pins uram_2w_2r_we_17/ce0]
connect_bd_net -net ce1_17_1 [get_bd_ports ce1_17] [get_bd_pins uram_2w_2r_we_17/ce1]
connect_bd_net [get_bd_pins uram_2w_2r_we_17/rdata0] [get_bd_ports rdata0_17]
connect_bd_net [get_bd_pins uram_2w_2r_we_17/rdata1] [get_bd_ports rdata1_17]
connect_bd_net -net wdata0_17_1 [get_bd_ports wdata0_17] [get_bd_pins uram_2w_2r_we_17/wdata0]
connect_bd_net -net wdata1_17_1 [get_bd_ports wdata1_17] [get_bd_pins uram_2w_2r_we_17/wdata1]
connect_bd_net -net we0_17_1 [get_bd_ports we0_17] [get_bd_pins uram_2w_2r_we_17/we0]
connect_bd_net -net we1_17_1 [get_bd_ports we1_17] [get_bd_pins uram_2w_2r_we_17/we1]
connect_bd_net -net addr0_18_1 [get_bd_ports addr0_18] [get_bd_pins uram_2w_2r_we_18/addr0]
connect_bd_net -net addr1_18_1 [get_bd_ports addr1_18] [get_bd_pins uram_2w_2r_we_18/addr1]
connect_bd_net -net ce0_18_1 [get_bd_ports ce0_18] [get_bd_pins uram_2w_2r_we_18/ce0]
connect_bd_net -net ce1_18_1 [get_bd_ports ce1_18] [get_bd_pins uram_2w_2r_we_18/ce1]
connect_bd_net [get_bd_pins uram_2w_2r_we_18/rdata0] [get_bd_ports rdata0_18]
connect_bd_net [get_bd_pins uram_2w_2r_we_18/rdata1] [get_bd_ports rdata1_18]
connect_bd_net -net wdata0_18_1 [get_bd_ports wdata0_18] [get_bd_pins uram_2w_2r_we_18/wdata0]
connect_bd_net -net wdata1_18_1 [get_bd_ports wdata1_18] [get_bd_pins uram_2w_2r_we_18/wdata1]
connect_bd_net -net we0_18_1 [get_bd_ports we0_18] [get_bd_pins uram_2w_2r_we_18/we0]
connect_bd_net -net we1_18_1 [get_bd_ports we1_18] [get_bd_pins uram_2w_2r_we_18/we1]
connect_bd_net -net addr0_19_1 [get_bd_ports addr0_19] [get_bd_pins uram_2w_2r_we_19/addr0]
connect_bd_net -net addr1_19_1 [get_bd_ports addr1_19] [get_bd_pins uram_2w_2r_we_19/addr1]
connect_bd_net -net ce0_19_1 [get_bd_ports ce0_19] [get_bd_pins uram_2w_2r_we_19/ce0]
connect_bd_net -net ce1_19_1 [get_bd_ports ce1_19] [get_bd_pins uram_2w_2r_we_19/ce1]
connect_bd_net [get_bd_pins uram_2w_2r_we_19/rdata0] [get_bd_ports rdata0_19]
connect_bd_net [get_bd_pins uram_2w_2r_we_19/rdata1] [get_bd_ports rdata1_19]
connect_bd_net -net wdata0_19_1 [get_bd_ports wdata0_19] [get_bd_pins uram_2w_2r_we_19/wdata0]
connect_bd_net -net wdata1_19_1 [get_bd_ports wdata1_19] [get_bd_pins uram_2w_2r_we_19/wdata1]
connect_bd_net -net we0_19_1 [get_bd_ports we0_19] [get_bd_pins uram_2w_2r_we_19/we0]
connect_bd_net -net we1_19_1 [get_bd_ports we1_19] [get_bd_pins uram_2w_2r_we_19/we1]
connect_bd_net -net addr0_20_1 [get_bd_ports addr0_20] [get_bd_pins uram_2w_2r_we_20/addr0]
connect_bd_net -net addr1_20_1 [get_bd_ports addr1_20] [get_bd_pins uram_2w_2r_we_20/addr1]
connect_bd_net -net ce0_20_1 [get_bd_ports ce0_20] [get_bd_pins uram_2w_2r_we_20/ce0]
connect_bd_net -net ce1_20_1 [get_bd_ports ce1_20] [get_bd_pins uram_2w_2r_we_20/ce1]
connect_bd_net [get_bd_pins uram_2w_2r_we_20/rdata0] [get_bd_ports rdata0_20]
connect_bd_net [get_bd_pins uram_2w_2r_we_20/rdata1] [get_bd_ports rdata1_20]
connect_bd_net -net wdata0_20_1 [get_bd_ports wdata0_20] [get_bd_pins uram_2w_2r_we_20/wdata0]
connect_bd_net -net wdata1_20_1 [get_bd_ports wdata1_20] [get_bd_pins uram_2w_2r_we_20/wdata1]
connect_bd_net -net we0_20_1 [get_bd_ports we0_20] [get_bd_pins uram_2w_2r_we_20/we0]
connect_bd_net -net we1_20_1 [get_bd_ports we1_20] [get_bd_pins uram_2w_2r_we_20/we1]
connect_bd_net -net addr0_21_1 [get_bd_ports addr0_21] [get_bd_pins uram_2w_2r_we_21/addr0]
connect_bd_net -net addr1_21_1 [get_bd_ports addr1_21] [get_bd_pins uram_2w_2r_we_21/addr1]
connect_bd_net -net ce0_21_1 [get_bd_ports ce0_21] [get_bd_pins uram_2w_2r_we_21/ce0]
connect_bd_net -net ce1_21_1 [get_bd_ports ce1_21] [get_bd_pins uram_2w_2r_we_21/ce1]
connect_bd_net [get_bd_pins uram_2w_2r_we_21/rdata0] [get_bd_ports rdata0_21]
connect_bd_net [get_bd_pins uram_2w_2r_we_21/rdata1] [get_bd_ports rdata1_21]
connect_bd_net -net wdata0_21_1 [get_bd_ports wdata0_21] [get_bd_pins uram_2w_2r_we_21/wdata0]
connect_bd_net -net wdata1_21_1 [get_bd_ports wdata1_21] [get_bd_pins uram_2w_2r_we_21/wdata1]
connect_bd_net -net we0_21_1 [get_bd_ports we0_21] [get_bd_pins uram_2w_2r_we_21/we0]
connect_bd_net -net we1_21_1 [get_bd_ports we1_21] [get_bd_pins uram_2w_2r_we_21/we1]
connect_bd_net -net addr0_22_1 [get_bd_ports addr0_22] [get_bd_pins uram_2w_2r_we_22/addr0]
connect_bd_net -net addr1_22_1 [get_bd_ports addr1_22] [get_bd_pins uram_2w_2r_we_22/addr1]
connect_bd_net -net ce0_22_1 [get_bd_ports ce0_22] [get_bd_pins uram_2w_2r_we_22/ce0]
connect_bd_net -net ce1_22_1 [get_bd_ports ce1_22] [get_bd_pins uram_2w_2r_we_22/ce1]
connect_bd_net [get_bd_pins uram_2w_2r_we_22/rdata0] [get_bd_ports rdata0_22]
connect_bd_net [get_bd_pins uram_2w_2r_we_22/rdata1] [get_bd_ports rdata1_22]
connect_bd_net -net wdata0_22_1 [get_bd_ports wdata0_22] [get_bd_pins uram_2w_2r_we_22/wdata0]
connect_bd_net -net wdata1_22_1 [get_bd_ports wdata1_22] [get_bd_pins uram_2w_2r_we_22/wdata1]
connect_bd_net -net we0_22_1 [get_bd_ports we0_22] [get_bd_pins uram_2w_2r_we_22/we0]
connect_bd_net -net we1_22_1 [get_bd_ports we1_22] [get_bd_pins uram_2w_2r_we_22/we1]
connect_bd_net -net addr0_23_1 [get_bd_ports addr0_23] [get_bd_pins uram_2w_2r_we_23/addr0]
connect_bd_net -net addr1_23_1 [get_bd_ports addr1_23] [get_bd_pins uram_2w_2r_we_23/addr1]
connect_bd_net -net ce0_23_1 [get_bd_ports ce0_23] [get_bd_pins uram_2w_2r_we_23/ce0]
connect_bd_net -net ce1_23_1 [get_bd_ports ce1_23] [get_bd_pins uram_2w_2r_we_23/ce1]
connect_bd_net [get_bd_pins uram_2w_2r_we_23/rdata0] [get_bd_ports rdata0_23]
connect_bd_net [get_bd_pins uram_2w_2r_we_23/rdata1] [get_bd_ports rdata1_23]
connect_bd_net -net wdata0_23_1 [get_bd_ports wdata0_23] [get_bd_pins uram_2w_2r_we_23/wdata0]
connect_bd_net -net wdata1_23_1 [get_bd_ports wdata1_23] [get_bd_pins uram_2w_2r_we_23/wdata1]
connect_bd_net -net we0_23_1 [get_bd_ports we0_23] [get_bd_pins uram_2w_2r_we_23/we0]
connect_bd_net -net we1_23_1 [get_bd_ports we1_23] [get_bd_pins uram_2w_2r_we_23/we1]
connect_bd_net -net addr0_24_1 [get_bd_ports addr0_24] [get_bd_pins uram_2w_2r_we_24/addr0]
connect_bd_net -net addr1_24_1 [get_bd_ports addr1_24] [get_bd_pins uram_2w_2r_we_24/addr1]
connect_bd_net -net ce0_24_1 [get_bd_ports ce0_24] [get_bd_pins uram_2w_2r_we_24/ce0]
connect_bd_net -net ce1_24_1 [get_bd_ports ce1_24] [get_bd_pins uram_2w_2r_we_24/ce1]
connect_bd_net [get_bd_pins uram_2w_2r_we_24/rdata0] [get_bd_ports rdata0_24]
connect_bd_net [get_bd_pins uram_2w_2r_we_24/rdata1] [get_bd_ports rdata1_24]
connect_bd_net -net wdata0_24_1 [get_bd_ports wdata0_24] [get_bd_pins uram_2w_2r_we_24/wdata0]
connect_bd_net -net wdata1_24_1 [get_bd_ports wdata1_24] [get_bd_pins uram_2w_2r_we_24/wdata1]
connect_bd_net -net we0_24_1 [get_bd_ports we0_24] [get_bd_pins uram_2w_2r_we_24/we0]
connect_bd_net -net we1_24_1 [get_bd_ports we1_24] [get_bd_pins uram_2w_2r_we_24/we1]
connect_bd_net -net addr0_25_1 [get_bd_ports addr0_25] [get_bd_pins uram_2w_2r_we_25/addr0]
connect_bd_net -net addr1_25_1 [get_bd_ports addr1_25] [get_bd_pins uram_2w_2r_we_25/addr1]
connect_bd_net -net ce0_25_1 [get_bd_ports ce0_25] [get_bd_pins uram_2w_2r_we_25/ce0]
connect_bd_net -net ce1_25_1 [get_bd_ports ce1_25] [get_bd_pins uram_2w_2r_we_25/ce1]
connect_bd_net [get_bd_pins uram_2w_2r_we_25/rdata0] [get_bd_ports rdata0_25]
connect_bd_net [get_bd_pins uram_2w_2r_we_25/rdata1] [get_bd_ports rdata1_25]
connect_bd_net -net wdata0_25_1 [get_bd_ports wdata0_25] [get_bd_pins uram_2w_2r_we_25/wdata0]
connect_bd_net -net wdata1_25_1 [get_bd_ports wdata1_25] [get_bd_pins uram_2w_2r_we_25/wdata1]
connect_bd_net -net we0_25_1 [get_bd_ports we0_25] [get_bd_pins uram_2w_2r_we_25/we0]
connect_bd_net -net we1_25_1 [get_bd_ports we1_25] [get_bd_pins uram_2w_2r_we_25/we1]
connect_bd_net -net addr0_26_1 [get_bd_ports addr0_26] [get_bd_pins uram_2w_2r_we_26/addr0]
connect_bd_net -net addr1_26_1 [get_bd_ports addr1_26] [get_bd_pins uram_2w_2r_we_26/addr1]
connect_bd_net -net ce0_26_1 [get_bd_ports ce0_26] [get_bd_pins uram_2w_2r_we_26/ce0]
connect_bd_net -net ce1_26_1 [get_bd_ports ce1_26] [get_bd_pins uram_2w_2r_we_26/ce1]
connect_bd_net [get_bd_pins uram_2w_2r_we_26/rdata0] [get_bd_ports rdata0_26]
connect_bd_net [get_bd_pins uram_2w_2r_we_26/rdata1] [get_bd_ports rdata1_26]
connect_bd_net -net wdata0_26_1 [get_bd_ports wdata0_26] [get_bd_pins uram_2w_2r_we_26/wdata0]
connect_bd_net -net wdata1_26_1 [get_bd_ports wdata1_26] [get_bd_pins uram_2w_2r_we_26/wdata1]
connect_bd_net -net we0_26_1 [get_bd_ports we0_26] [get_bd_pins uram_2w_2r_we_26/we0]
connect_bd_net -net we1_26_1 [get_bd_ports we1_26] [get_bd_pins uram_2w_2r_we_26/we1]
connect_bd_net -net addr0_27_1 [get_bd_ports addr0_27] [get_bd_pins uram_2w_2r_we_27/addr0]
connect_bd_net -net addr1_27_1 [get_bd_ports addr1_27] [get_bd_pins uram_2w_2r_we_27/addr1]
connect_bd_net -net ce0_27_1 [get_bd_ports ce0_27] [get_bd_pins uram_2w_2r_we_27/ce0]
connect_bd_net -net ce1_27_1 [get_bd_ports ce1_27] [get_bd_pins uram_2w_2r_we_27/ce1]
connect_bd_net [get_bd_pins uram_2w_2r_we_27/rdata0] [get_bd_ports rdata0_27]
connect_bd_net [get_bd_pins uram_2w_2r_we_27/rdata1] [get_bd_ports rdata1_27]
connect_bd_net -net wdata0_27_1 [get_bd_ports wdata0_27] [get_bd_pins uram_2w_2r_we_27/wdata0]
connect_bd_net -net wdata1_27_1 [get_bd_ports wdata1_27] [get_bd_pins uram_2w_2r_we_27/wdata1]
connect_bd_net -net we0_27_1 [get_bd_ports we0_27] [get_bd_pins uram_2w_2r_we_27/we0]
connect_bd_net -net we1_27_1 [get_bd_ports we1_27] [get_bd_pins uram_2w_2r_we_27/we1]
connect_bd_net -net addr0_28_1 [get_bd_ports addr0_28] [get_bd_pins uram_2w_2r_we_28/addr0]
connect_bd_net -net addr1_28_1 [get_bd_ports addr1_28] [get_bd_pins uram_2w_2r_we_28/addr1]
connect_bd_net -net ce0_28_1 [get_bd_ports ce0_28] [get_bd_pins uram_2w_2r_we_28/ce0]
connect_bd_net -net ce1_28_1 [get_bd_ports ce1_28] [get_bd_pins uram_2w_2r_we_28/ce1]
connect_bd_net [get_bd_pins uram_2w_2r_we_28/rdata0] [get_bd_ports rdata0_28]
connect_bd_net [get_bd_pins uram_2w_2r_we_28/rdata1] [get_bd_ports rdata1_28]
connect_bd_net -net wdata0_28_1 [get_bd_ports wdata0_28] [get_bd_pins uram_2w_2r_we_28/wdata0]
connect_bd_net -net wdata1_28_1 [get_bd_ports wdata1_28] [get_bd_pins uram_2w_2r_we_28/wdata1]
connect_bd_net -net we0_28_1 [get_bd_ports we0_28] [get_bd_pins uram_2w_2r_we_28/we0]
connect_bd_net -net we1_28_1 [get_bd_ports we1_28] [get_bd_pins uram_2w_2r_we_28/we1]
connect_bd_net -net addr0_29_1 [get_bd_ports addr0_29] [get_bd_pins uram_2w_2r_we_29/addr0]
connect_bd_net -net addr1_29_1 [get_bd_ports addr1_29] [get_bd_pins uram_2w_2r_we_29/addr1]
connect_bd_net -net ce0_29_1 [get_bd_ports ce0_29] [get_bd_pins uram_2w_2r_we_29/ce0]
connect_bd_net -net ce1_29_1 [get_bd_ports ce1_29] [get_bd_pins uram_2w_2r_we_29/ce1]
connect_bd_net [get_bd_pins uram_2w_2r_we_29/rdata0] [get_bd_ports rdata0_29]
connect_bd_net [get_bd_pins uram_2w_2r_we_29/rdata1] [get_bd_ports rdata1_29]
connect_bd_net -net wdata0_29_1 [get_bd_ports wdata0_29] [get_bd_pins uram_2w_2r_we_29/wdata0]
connect_bd_net -net wdata1_29_1 [get_bd_ports wdata1_29] [get_bd_pins uram_2w_2r_we_29/wdata1]
connect_bd_net -net we0_29_1 [get_bd_ports we0_29] [get_bd_pins uram_2w_2r_we_29/we0]
connect_bd_net -net we1_29_1 [get_bd_ports we1_29] [get_bd_pins uram_2w_2r_we_29/we1]
connect_bd_net -net addr0_30_1 [get_bd_ports addr0_30] [get_bd_pins uram_2w_2r_we_30/addr0]
connect_bd_net -net addr1_30_1 [get_bd_ports addr1_30] [get_bd_pins uram_2w_2r_we_30/addr1]
connect_bd_net -net ce0_30_1 [get_bd_ports ce0_30] [get_bd_pins uram_2w_2r_we_30/ce0]
connect_bd_net -net ce1_30_1 [get_bd_ports ce1_30] [get_bd_pins uram_2w_2r_we_30/ce1]
connect_bd_net [get_bd_pins uram_2w_2r_we_30/rdata0] [get_bd_ports rdata0_30]
connect_bd_net [get_bd_pins uram_2w_2r_we_30/rdata1] [get_bd_ports rdata1_30]
connect_bd_net -net wdata0_30_1 [get_bd_ports wdata0_30] [get_bd_pins uram_2w_2r_we_30/wdata0]
connect_bd_net -net wdata1_30_1 [get_bd_ports wdata1_30] [get_bd_pins uram_2w_2r_we_30/wdata1]
connect_bd_net -net we0_30_1 [get_bd_ports we0_30] [get_bd_pins uram_2w_2r_we_30/we0]
connect_bd_net -net we1_30_1 [get_bd_ports we1_30] [get_bd_pins uram_2w_2r_we_30/we1]
connect_bd_net -net addr0_31_1 [get_bd_ports addr0_31] [get_bd_pins uram_2w_2r_we_31/addr0]
connect_bd_net -net addr1_31_1 [get_bd_ports addr1_31] [get_bd_pins uram_2w_2r_we_31/addr1]
connect_bd_net -net ce0_31_1 [get_bd_ports ce0_31] [get_bd_pins uram_2w_2r_we_31/ce0]
connect_bd_net -net ce1_31_1 [get_bd_ports ce1_31] [get_bd_pins uram_2w_2r_we_31/ce1]
connect_bd_net [get_bd_pins uram_2w_2r_we_31/rdata0] [get_bd_ports rdata0_31]
connect_bd_net [get_bd_pins uram_2w_2r_we_31/rdata1] [get_bd_ports rdata1_31]
connect_bd_net -net wdata0_31_1 [get_bd_ports wdata0_31] [get_bd_pins uram_2w_2r_we_31/wdata0]
connect_bd_net -net wdata1_31_1 [get_bd_ports wdata1_31] [get_bd_pins uram_2w_2r_we_31/wdata1]
connect_bd_net -net we0_31_1 [get_bd_ports we0_31] [get_bd_pins uram_2w_2r_we_31/we0]
connect_bd_net -net we1_31_1 [get_bd_ports we1_31] [get_bd_pins uram_2w_2r_we_31/we1]

validate_bd_design
save_bd_design
